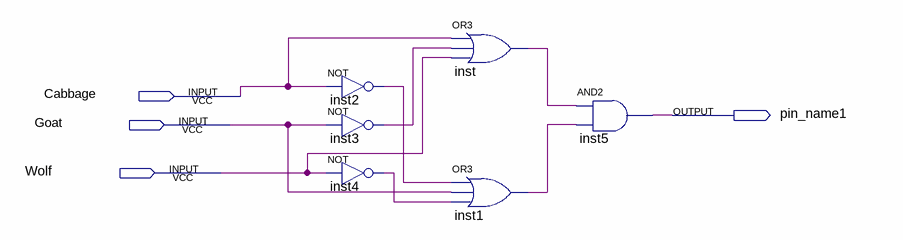
[diagram p0: schematic sheet]
// Quartus schematic lab3.bdf as structural Verilog: 6 symbols, 4 pins
module lab3 (
  input  Cabbage,
  input  Goat,
  input  Wolf,
  output pin_name1
);

  wire inst1_out, inst2_out, inst3_out, inst4_out, inst_out;

  not inst2 (inst2_out, Cabbage);
  not inst3 (inst3_out, Goat);
  not inst4 (inst4_out, Wolf);
  or inst (inst_out, Cabbage, inst3_out, Wolf);
  or inst1 (inst1_out, inst2_out, Goat, inst4_out);
  and inst5 (pin_name1, inst_out, inst1_out);
endmodule
